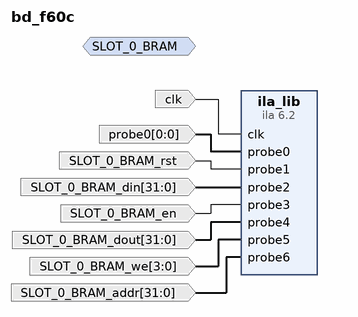
[diagram p0: block diagram of the top level]
# Vivado block design bd_f60c, xazu5ev-sfvc784-1-i, Vivado 2020.1
create_bd_design bd_f60c

create_bd_intf_port -mode Monitor -vlnv xilinx.com:interface:bram_rtl:1.0 SLOT_0_BRAM
set_property -dict {CONFIG.MASTER_TYPE BRAM_CTRL} [get_bd_intf_ports SLOT_0_BRAM]
create_bd_port -dir I -type clk clk
create_bd_port -dir I -from 0 -to 0 probe0
create_bd_port -dir I -type rst SLOT_0_BRAM_rst
create_bd_port -dir I -from 31 -to 0 SLOT_0_BRAM_din
create_bd_port -dir I SLOT_0_BRAM_en
create_bd_port -dir I -from 31 -to 0 SLOT_0_BRAM_dout
create_bd_port -dir I -from 3 -to 0 SLOT_0_BRAM_we
create_bd_port -dir I -from 31 -to 0 SLOT_0_BRAM_addr

create_bd_cell -type ip -vlnv xilinx.com:ip:ila:6.2 ila_lib
set_property -dict [list \
  CONFIG.ALL_PROBE_SAME_MU TRUE \
  CONFIG.ALL_PROBE_SAME_MU_CNT 1 \
  CONFIG.C_ADV_TRIGGER FALSE \
  CONFIG.C_DATA_DEPTH 1024 \
  CONFIG.C_EN_STRG_QUAL 0 \
  CONFIG.C_EN_TIME_TAG 0 \
  CONFIG.C_ILA_CLK_FREQ 99999001 \
  CONFIG.C_INPUT_PIPE_STAGES 0 \
  CONFIG.C_MONITOR_TYPE Native \
  CONFIG.C_NUM_OF_PROBES 7 \
  CONFIG.C_PROBE0_MU_CNT 1 \
  CONFIG.C_PROBE0_TYPE 0 \
  CONFIG.C_PROBE0_WIDTH 1 \
  CONFIG.C_PROBE1_TYPE 0 \
  CONFIG.C_PROBE1_WIDTH 1 \
  CONFIG.C_PROBE2_TYPE 0 \
  CONFIG.C_PROBE2_WIDTH 32 \
  CONFIG.C_PROBE3_TYPE 0 \
  CONFIG.C_PROBE3_WIDTH 1 \
  CONFIG.C_PROBE4_TYPE 0 \
  CONFIG.C_PROBE4_WIDTH 32 \
  CONFIG.C_PROBE5_TYPE 0 \
  CONFIG.C_PROBE5_WIDTH 4 \
  CONFIG.C_PROBE6_TYPE 0 \
  CONFIG.C_PROBE6_WIDTH 32 \
  CONFIG.C_TIME_TAG_WIDTH 32 \
  CONFIG.C_TRIGIN_EN false \
  CONFIG.C_TRIGOUT_EN false \
  CONFIG.C_XLNX_HW_PROBE_INFO DEFAULT \
] [get_bd_cells ila_lib]

# ---- connections ----

connect_bd_net [get_bd_ports clk] [get_bd_pins ila_lib/clk]
connect_bd_net -net probe0_1 [get_bd_ports probe0] [get_bd_pins ila_lib/probe0]
connect_bd_net [get_bd_ports SLOT_0_BRAM_rst] [get_bd_pins ila_lib/probe1]
connect_bd_net [get_bd_ports SLOT_0_BRAM_din] [get_bd_pins ila_lib/probe2]
connect_bd_net [get_bd_ports SLOT_0_BRAM_en] [get_bd_pins ila_lib/probe3]
connect_bd_net [get_bd_ports SLOT_0_BRAM_dout] [get_bd_pins ila_lib/probe4]
connect_bd_net [get_bd_ports SLOT_0_BRAM_we] [get_bd_pins ila_lib/probe5]
connect_bd_net [get_bd_ports SLOT_0_BRAM_addr] [get_bd_pins ila_lib/probe6]

validate_bd_design
save_bd_design
